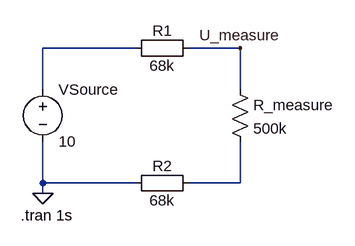
[diagram p0: schematic thevenin.asc]
thevenin.asc, the LTspice schematic file:
Version 4
SHEET 1 880 680
WIRE 16 32 -128 32
WIRE 176 32 96 32
WIRE -128 96 -128 32
WIRE 176 96 176 32
WIRE -128 240 -128 176
WIRE 16 240 -128 240
WIRE 176 240 176 176
WIRE 176 240 96 240
WIRE -128 256 -128 240
FLAG -128 256 0
FLAG 176 32 U_measure
SYMBOL voltage -128 80 R0
WINDOW 123 0 0 Left 0
WINDOW 39 0 0 Left 0
SYMATTR InstName VSource
SYMATTR Value 10
SYMBOL Misc\\EuropeanResistor 112 16 R90
WINDOW 0 5 56 VBottom 0
WINDOW 3 27 56 VTop 0
SYMATTR InstName R1
SYMATTR Value 68k
SYMBOL Misc\\EuropeanResistor 112 224 R90
WINDOW 0 5 56 VBottom 0
WINDOW 3 27 56 VTop 0
SYMATTR InstName R2
SYMATTR Value 68k
SYMBOL res 160 80 R0
SYMATTR InstName R_measure
SYMATTR Value 500k
TEXT -162 290 Left 0 !.tran 1s

The netlist it stands for:
* thevenin.asc
VSource N001 0 10
R1 U_measure N001 68k
R2 N002 0 68k
R_measure U_measure N002 500k
.tran 1s
.backanno
.end